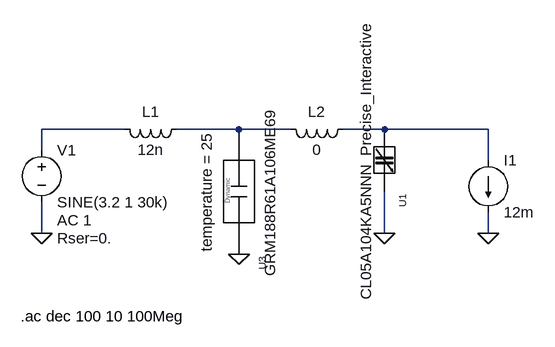
[diagram p0: schematic decoupling_resonance.asc]
decoupling_resonance.asc, the LTspice schematic file:
Version 4
SHEET 1 880 680
WIRE -16 128 -144 128
WIRE 160 128 64 128
WIRE 240 128 160 128
WIRE 384 128 320 128
WIRE 544 128 384 128
WIRE -144 160 -144 128
WIRE 544 176 544 128
WIRE -144 288 -144 240
WIRE 384 288 384 224
WIRE 544 288 544 256
FLAG -144 288 0
FLAG 384 288 0
FLAG 544 288 0
FLAG 160 320 0
SYMBOL CL05A104KA5NNN_Precise_Interactive_LT 384 176 R90
SYMATTR InstName U1
SYMBOL voltage -144 144 R0
WINDOW 123 24 124 Left 2
WINDOW 39 24 152 Left 2
SYMATTR InstName V1
SYMATTR Value SINE(3.2 1 30k)
SYMATTR Value2 AC 1
SYMATTR SpiceLine Rser=0.
SYMBOL ind 80 112 R90
WINDOW 0 5 56 VBottom 2
WINDOW 3 32 56 VTop 2
SYMATTR InstName L1
SYMATTR Value 12n
SYMATTR SpiceLine Rser=0
SYMBOL ind 336 112 R90
WINDOW 0 5 56 VBottom 2
WINDOW 3 32 56 VTop 2
SYMATTR InstName L2
SYMATTR Value 0
SYMATTR SpiceLine Rser=0
SYMBOL current 544 176 R0
WINDOW 123 0 0 Left 0
WINDOW 39 0 0 Left 0
SYMATTR InstName I1
SYMATTR Value 12m
SYMBOL GRM188R61A106ME69_LT 160 224 R90
SYMATTR InstName U3
TEXT -176 416 Left 2 !.ac dec 100 10 100Meg

The netlist it stands for:
* decoupling_resonance.asc
XU1 0 N003 CL05A104KA5NNN_Precise_Interactive  ; pins A B
V1 N001 0 SINE(3.2 1 30k) AC 1 Rser=0.
L1 N002 N001 12n Rser=0
L2 N003 N002 0 Rser=0
I1 N003 0 12m
XU3 N002 0 GRM188R61A106ME69 temperature = 25  ; pins port1 port2
.ac dec 100 10 100Meg
.lib CL05A104KA5NNN_Precise_Interactive_LT.mod
.lib GRM188R61A106ME69_LT.mod
.backanno
.end